# EAGLE schematic Scheme (EAGLE 7.5.0)
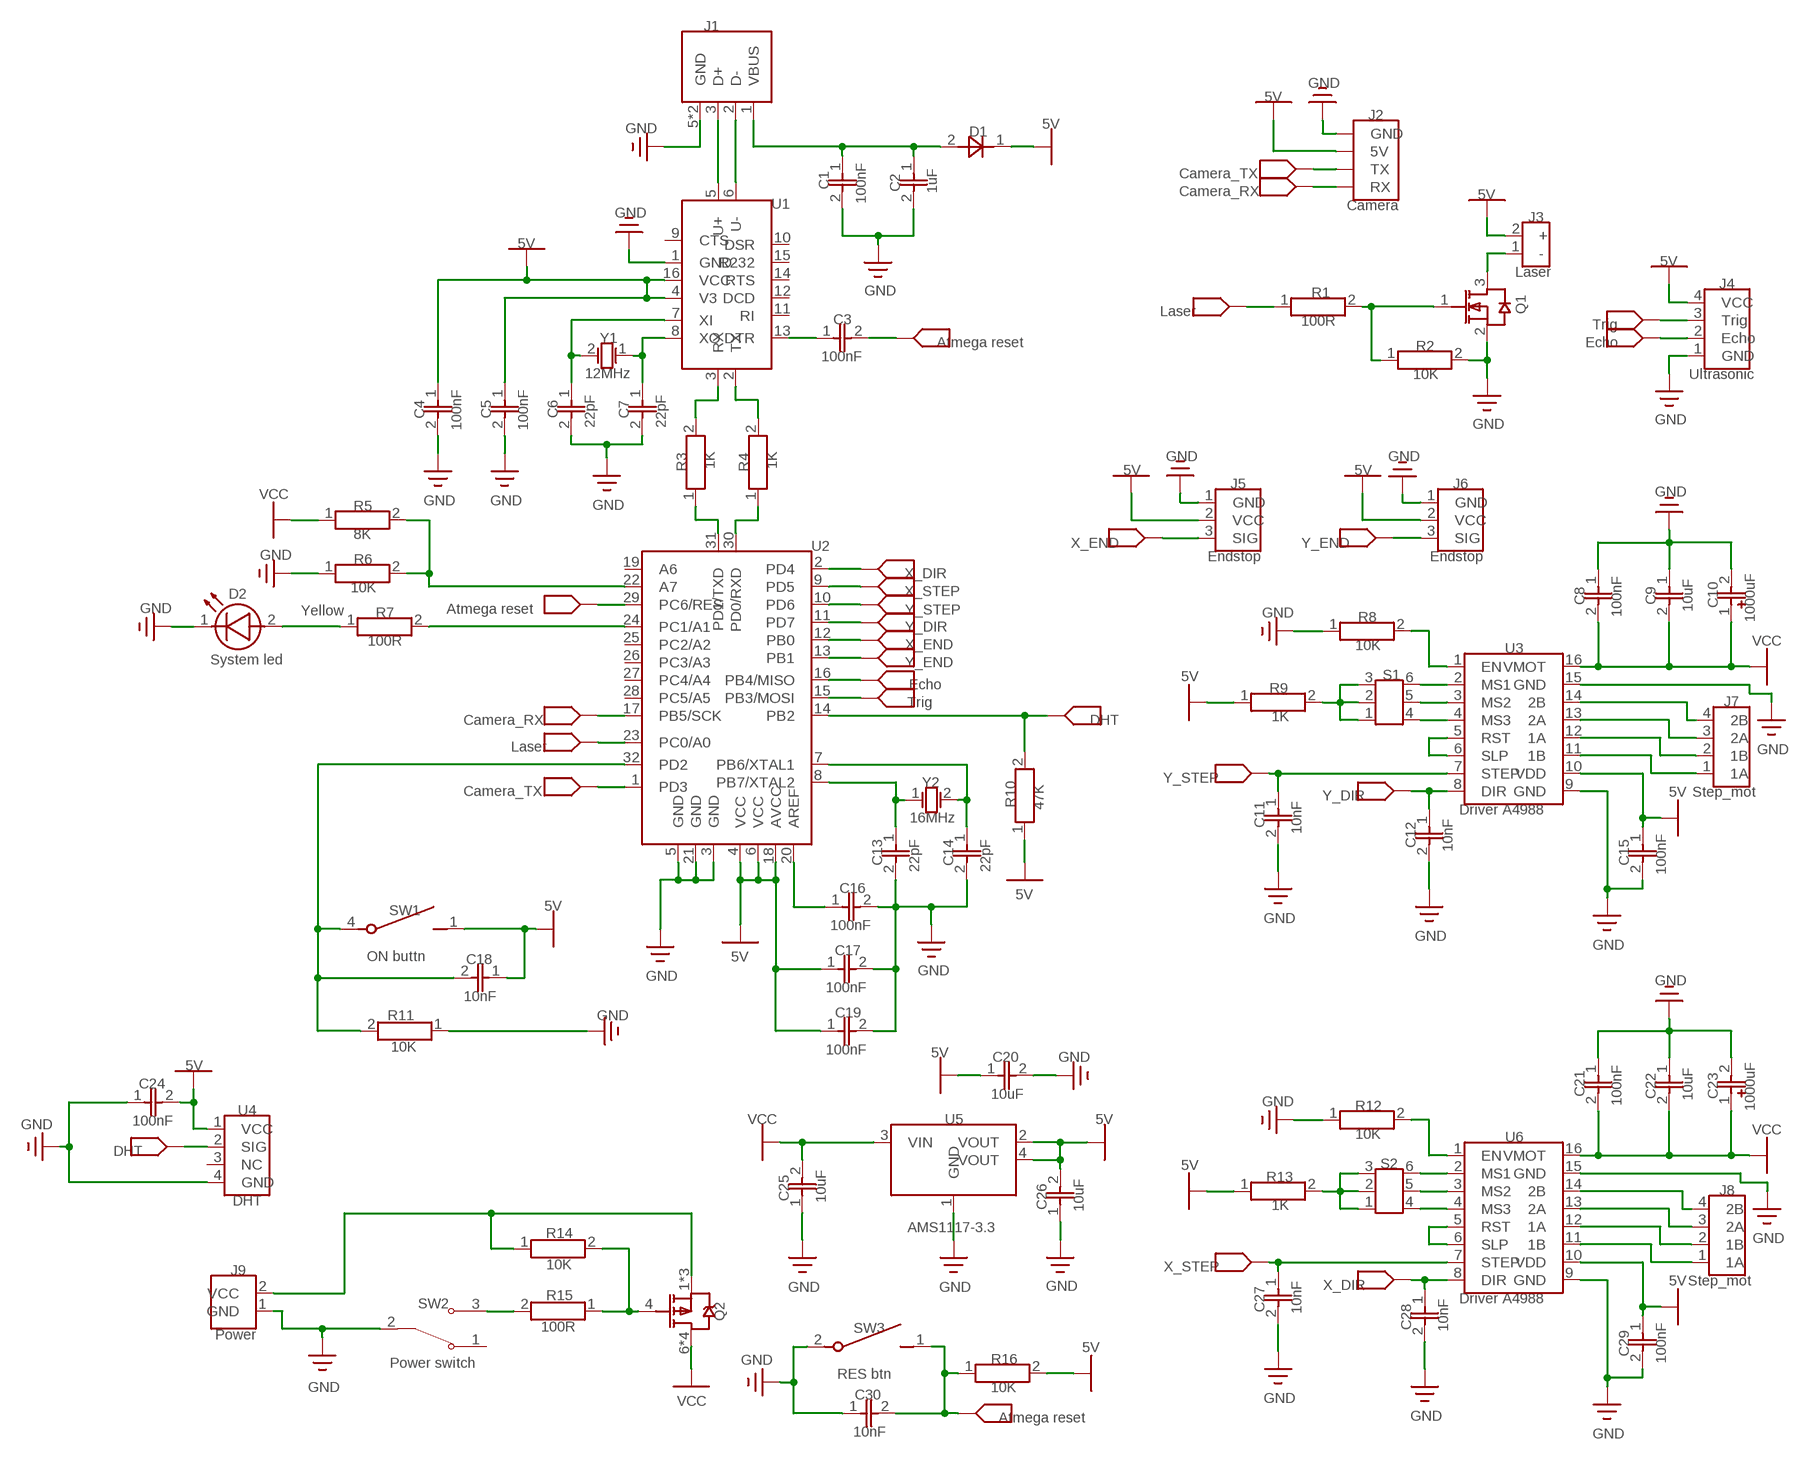
[diagram p0: schematic, sheet 1]

## Parts
C1  100nF  CAP  [CAP]
C2  1uF  CAP  [CAP]
C3  100nF  CAP  [CAP]
C4  100nF  CAP  [CAP]
C5  100nF  CAP  [CAP]
C6  22pF  CAP  [CAP]
C7  22pF  CAP  [CAP]
C8  100nF  CAP  [CAP]
C9  10uF  CAP  [CAP]
C10  1000uF  CAP_POLARIZED  [CAPAE-10.3X10.3H13.5]
C11  10nF  CAP  [CAP]
C12  10nF  CAP  [CAP]
C13  22pF  CAP  [CAP]
C14  22pF  CAP  [CAP]
C15  100nF  CAP  [CAP]
C16  100nF  CAP  [CAP]
C17  100nF  CAP  [CAP]
C18  10nF  CAP_2  [CAP]
C19  100nF  CAP  [CAP]
C20  10uF  CAP  [CAP]
C21  100nF  CAP  [CAP]
C22  10uF  CAP  [CAP]
C23  1000uF  CAP_POLARIZED  [CAPAE-10.3X10.3H13.5]
C24  100nF  CAP  [CAP]
C25  10uF  CAP  [CAP]
C26  10uF  CAP  [CAP]
C27  10nF  CAP  [CAP]
C28  10nF  CAP  [CAP]
C29  100nF  CAP  [CAP]
C30  10nF  CAP  [CAP]
D1  DIO  [DIODE]
D2  Yellow  SYSTEM_LED  [LED_0805(2012_METRIC)_N_RED]
J1  USB  [JEEC_920-E52A2021S10100]
J2  CAMERA  (no package)
J3  LASER  [B2B-XH-A]
J4  ULTRASONIC  [B4B-XH-A]
J5  ENDSTOP  [B3B-XH-A]
J6  ENDSTOP  [B3B-XH-A]
J7  STEP_MOT  [B4B-XH-A]
J8  STEP_MOT  [B4B-XH-A]
J9  POWER  [B2B-XH-A]
Q1  N_MOSPFET  [SOT23-3P95_230X110L30X43N]
Q2  IRF4905LPBF  [SOIC8P127_488X585X363L48X40M]
R1  100R  RES  [RES]
R2  10K  RES  [RES]
R3  1K  RES  [RES]
R4  1K  RES  [RES]
R5  8K  RES  [RES]
R6  10K  RES  [RES]
R7  100R  RES  [RES]
R8  10K  RES  [RES]
R9  1K  RES  [RES]
R10  47K  RES  [RES]
R11  10K  RES_39  [RES]
R12  10K  RES  [RES]
R13  1K  RES  [RES]
R14  10K  RES  [RES]
R15  100R  RES  [RES]
R16  10K  RES  [RES]
S1  3XSWITCH  [UNTITLED]
S2  3XSWITCH  [UNTITLED]
SW1  ON_BUTTN  [BUTTON]
SW2  POWER_SWITCH  [CK_PVA2-H1]
SW3  RES_BTN  [RES_BTN]
U1  CH340G  [SOIC16P127_1000X600X180L50X45N]
U2  ATMEGA328P  [QFP32P80_900X900X120L60X37L_AD2]
U3  DRIVER_A4988  [UNTITLED_15]
U4  DHT_12  [DHT22]
U5  AMS1117-3.3  [SOT223-4P230_700X180L100X70N_AD1]
U6  DRIVER_A4988  [UNTITLED_15]
Y1  12MHz  HC49/4HSMX  [XTAL1140X490X430D1340L450X60N]
Y2  16MHz  HC49/4HSMX  [XTAL1140X490X430D1340L450X60N]

## Nets
Gnd: C1.2 C2.2 C4.2 C5.2 C6.2 C7.2 C8.1 C9.1 C10.2(MINUS) C11.2 C12.2 C13.2 C14.2 C15.2 C16.2 C17.2 C19.2 C20.2 C21.1 C22.1 C23.2(MINUS) C24.1 C25.1 C26.1 C27.2 C28.2 C29.2 C30.1 D2.1(K) J1.5(GND) J1.6@_3(GND) J2.GND J4.1(GND) J5.1(GND) J6.1(GND) J9.1(GND) Q1.2(S) R2.2 R6.1 R8.1 R11.1 R12.1 SW2.2 SW3.2(C2) U1.1(GND) U2.3(GND) U2.5(GND) U2.21(GND) U3.9(GND) U3.15(GND) U4.4(GND) U5.1(GND) U6.9(GND) U6.15(GND) ; supply symbol labelled GND, GND_4
Net_0: Q1.1(G) R1.2 R2.1
Net_2: C8.2 C9.2 C10.1(PLUS) C21.2 C22.2 C23.1(PLUS) C25.2 Q2.5(D) Q2.6(D) Q2.7(D) Q2.8(D) R5.1 U3.16(VMOT) U5.3(VIN) U6.16(VMOT) ; supply symbol labelled VCC_27, VCC
Net_3: U6.5(RST) U6.6(SLP)
Net_4: U3.5(RST) U3.6(SLP)
Net_5: J7.4(2B) U3.14(2B)
Net_6: J7.3(2A) U3.13(2A)
Net_7: J7.2(1B) U3.12(1A)
Net_8: J7.1(1A) U3.11(1B)
Net_12: R9.2 S1.1 S1.2 S1.3
Net_13: R8.2 U3.1(EN)
Net_16: J4.2(Echo) U2.16(PB4/MISO) ; supply symbol labelled ECHO
Net_18: R5.2 R6.2 U2.22(A7)
Net_19: J8.4(2B) U6.14(2B)
Net_20: J8.3(2A) U6.13(2A)
Net_21: J8.2(1B) U6.12(1A)
Net_22: J8.1(1A) U6.11(1B)
Net_23: S2.6 U6.2(MS1)
Net_24: S2.5 U6.3(MS2)
Net_25: S2.4 U6.4(MS3)
Net_26: R13.2 S2.1 S2.2 S2.3
Net_27: R12.2 U6.1(EN)
Net_28: C27.1 U2.9(PD5) U6.7(STEP) ; supply symbol labelled X_STEP
Net_29: C28.1 U2.2(PD4) U6.8(DIR) ; supply symbol labelled X_DIR
Net_30: C11.1 U2.10(PD6) U3.7(STEP) ; supply symbol labelled Y_STEP
Net_31: J9.2(VCC) Q2.1(S) Q2.2(S) Q2.3(S) R14.1
Net_32: R15.2 SW2.3
Net_33: Q2.4(G) R14.2 R15.1
Net_34: J2.TX U2.1(PD3) ; supply symbol labelled CAMERA_TX
Net_36: S1.4 U3.4(MS3)
Net_37: S1.5 U3.3(MS2)
Net_38: S1.6 U3.2(MS1)
Net_41: C12.1 U2.11(PD7) U3.8(DIR) ; supply symbol labelled Y_DIR
Net_42: J5.3(SIG) U2.12(PB0) ; supply symbol labelled X_END
Net_43: J6.3(SIG) U2.13(PB1) ; supply symbol labelled Y_END
Net_68: J3.1(-) Q1.3(D)
Net_69: R3.1 U2.31(PD1/TXD)
Net_70: R1.1 U2.23(PC0/A0) ; supply symbol labelled LASER_35
Net_72: R4.2 U1.2(TX)
Net_73: R3.2 U1.3(RX)
Net_74: C3.1 U1.13(DTR)
Net_75: J4.3(Trig) U2.15(PB3/MOSI) ; supply symbol labelled TRIG
Net_76: J1.3(D+) U1.5(U+)
Net_77: J1.2(D-) U1.6(U-)
Net_78: C1.1 C2.1 D1.2(A) J1.1(VBUS)
Net_82: R7.2 U2.24(PC1/A1)
Net_83: D2.2(A) R7.1
Net_85: C18.2 R11.2 SW1.4(C2) U2.32(PD2)
Net_87: C3.2 C30.2 R16.1 SW3.1(C1) U2.29(PC6/RES) ; supply symbol labelled ATMEGA_RESET
Net_88: J2.RX U2.17(PB5/SCK) ; supply symbol labelled CAMERA_RX
Net_97: C14.1 U2.7(PB6/XTAL1) Y2.2(OSC2)
Net_100: C16.1 U2.20(AREF)
Net_105: R4.1 U2.30(PD0/RXD)
Net_110: C7.1 U1.8(XO) Y1.1(OSC1)
Net_111: C6.1 U1.7(XI) Y1.2(OSC2)
Net_125: R10.2 U2.14(PB2) U4.2(SIG) ; supply symbol labelled DHT
Net_155: C13.1 U2.8(PB7/XTAL2) Y2.1(OSC1)
USBVCC: C4.1 C5.1 C15.1 C17.1 C18.1 C19.1 C20.1 C24.2 C26.2 C29.1 D1.1(C) J2.5V J3.2(+) J4.4(VCC) J5.2(VCC) J6.2(VCC) R9.1 R10.1 R13.1 R16.2 SW1.1(C1) U1.4(V3) U1.16(VCC) U2.4(VCC) U2.6(VCC) U2.18(AVCC) U3.10(VDD) U4.1(VCC) U5.2(VOUT) U5.4(VOUT) U6.10(VDD) ; supply symbol labelled 5V_31, 5V
Unconnected: SW2.1 U1.9(CTS) U1.10(DSR) U1.11(RI) U1.12(DCD) U1.14(RTS) U1.15(R232) U2.19(A6) U2.25(PC2/A2) U2.26(PC3/A3) U2.27(PC4/A4) U2.28(PC5/A5) U4.3(NC)

## Notes on the sheet
- J1
- GND
- 5V
- J2
- 5V
- GND | D1
- Camera_TX
- C1 | C2 | 1uF
- Camera_RX | Camera | 5V
- 100nF
- U1
- GND
- J3
- 5V
- Laser | 5V
- J4
- GND | R1
- Laser | 100R | Q1
- C3
- Trig
- Y1
- 100nF | Atmega reset | R2 | Echo
- 12MHz | 10K | Ultrasonic
- C4 | C5 | C6 | C7
- 22pF | 22pF | GND
- 100nF | 100nF | GND
- GND | GND
- R3 | 1K | R4 | 1K
- 5V | 5V
- J5 | J6
- VCC | GND
- GND | GND
- R5 | GND
- 8K
- U2 | X_END | Endstop | Y_END | Endstop
- GND
- R6
- 10K | X_DIR
- D2 | X_STEP
- Yellow | C8 | C9 | C10
- GND | Atmega reset | Y_STEP | 10uF
- R7 | GND | 100nF
- R8 | 1000uF
- 100R | Y_DIR
- 10K
- X_END | VCC
- System led | U3
- Y_END
- 5V | S1
- Echo | R9
- Trig | J7
- 1K
- Camera_RX | DHT
- Laser | GND
- Y_STEP | Step_mot
- Y2
- Camera_TX | 5V
- Y_DIR | Driver A4988
- R10 | 47K
- 16MHz
- C11
- 10nF
- C12 | 10nF
- C13 | C14 | C15
- 22pF | 22pF | 100nF
- C16
- 5V
- 5V
- SW1
- 100nF | GND
- GND
- ON buttn | GND
- C17
- C18 | 5V
- GND
- GND | 100nF
- GND
- 10nF
- R11 | GND | C19
- 10K | 100nF
- 5V
- C20 | GND
- 5V
- C24 | 10uF
- C21 | C22 | 10uF | C23
- GND | 100nF
- R12 | 1000uF
- 100nF | U4
- VCC | U5 | 5V
- GND | 10K
- VCC
- U6
- DHT
- 5V | S2
- R13
- DHT | J8
- C25 | 10uF | 1K
- C26 | 10uF
- AMS1117-3.3
- R14
- GND
- 10K
- J9 | X_STEP | Step_mot
- 5V
- GND | GND | GND | X_DIR | Driver A4988
- R15 | Q2
- SW2 | C27
- 10nF
- 100R
- Power | SW3 | C28 | 10nF
- 5V | C29
- Power switch
- GND | R16 | 100nF
- RES btn
- 10K
- GND
- C30 | GND
- VCC
- Atmega reset | GND
- 10nF
- GND

## Library data of the parts
C1 C3-C5 C8 C15-C17 C19 C21 C24 C29 = common:CAP; DESCRIPTION: Capacitor
C2 C6 C7 C9 C11-C14 C20 C22 C25-C28 C30 = common:CAP; DESCRIPTION: Capacitor; VALUE: 100nF
C10 C23 = common:CAP_POLARIZED; DESCRIPTION_1: Capacitor; DESCRIPTION_2: Polarized
C18 = common:CAP_2; DESCRIPTION: Capacitor
D1 = common:DIO; DESCRIPTION: Diode
D2 = common:SYSTEM_LED; MANUFACTURER: https://www.chipdip.ru/product/kp-2012ec; UNIQUE_NAME: LED100
J1 = common:USB
J2 = common:CAMERA
J3 = common:LASER
J4 = common:ULTRASONIC
J5 J6 = common:ENDSTOP
J7 J8 = common:STEP_MOT
J9 = common:POWER
Q1 = common:N_MOSPFET
Q2 = common:IRF4905LPBF; MANUFACTURER: https://www.chipdip.ru/product/irf9310trpbf-infineon; PART_NUMBER_(DIGI-KEY): IRF4905LPBF-ND; PART_NUMBER_(LCSC): C537768; UNIQUE_NAME: IR_TO-220AB
R1 R7 R15 = common:RES; DESCRIPTION: Resistor
R2-R6 R8-R10 R12-R14 R16 = common:RES; DESCRIPTION: Resistor; VALUE: 100R
R11 = common:RES_39; DESCRIPTION: Resistor
S1 S2 = common:3XSWITCH
SW1 = common:ON_BUTTN; DESCRIPTION: Make Contact; MANUFACTURER: https://www.chipdip.ru/product0/8007094223
SW2 = common:POWER_SWITCH; DESCRIPTION: Toggle Switch SPDT Through Hole; MANUFACTURER: https://www.chipdip.ru/product0/8003917651
SW3 = common:RES_BTN; DESCRIPTION: Make Contact; MANUFACTURER: https://www.chipdip.ru/product0/8007094223
U1 = common:CH340G
U2 = common:ATMEGA328P
U3 U6 = common:DRIVER_A4988
U4 = common:DHT_12
U5 = common:AMS1117-3.3; DATASHEET: http://datasheets.diptrace.com/jsmsemi/AMS1117-3.3.pdf; MANUFACTURER: JSMSEMI; PART_NUMBER_(LCSC): C917183; UNIQUE_NAME: JSMSEMI_SOT-223-3L
Y1 = common:HC49/4HSMX; DATASHEET: http://datasheets.diptrace.com/crystals/hc49-4hsmx.pdf; MANUFACTURER: IQD; UNIQUE_NAME: IQD_HC49_4H
Y2 = common:HC49/4HSMX; DATASHEET: http://datasheets.diptrace.com/crystals/hc49-4hsmx.pdf; MANUFACTURER: IQD; UNIQUE_NAME: IQD_HC49_4H; VALUE: 12MHz